# EAGLE schematic AM6548 (EAGLE 9.4.2), part 4 of 4
## Sheet 17 of 19: Management IC
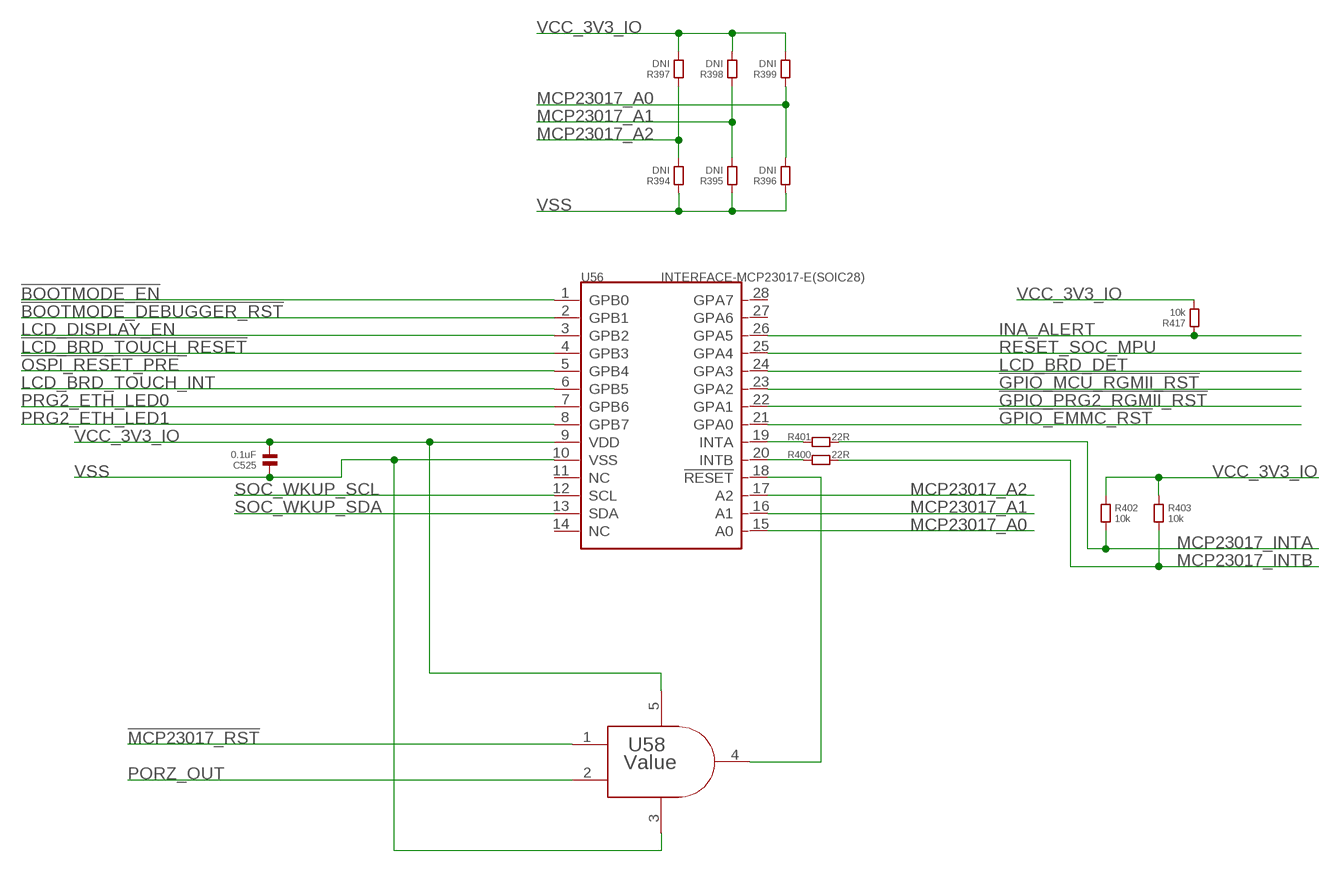
[diagram p30: schematic, sheet 17]

### Parts
C525  0.1uF  CAPACITOR.0603  [0603]
R394  DNI  RESISTOR.0402  [0402]
R395  DNI  RESISTOR.0402  [0402]
R396  DNI  RESISTOR.0402  [0402]
R397  DNI  RESISTOR.0402  [0402]
R398  DNI  RESISTOR.0402  [0402]
R399  DNI  RESISTOR.0402  [0402]
R400  22R  RESISTOR.0603  [0603]
R401  22R  RESISTOR.0603  [0603]
R402  10k  RESISTOR.0603  [0603]
R403  10k  RESISTOR.0603  [0603]
R417  10k  RESISTOR.0402  [0402]
U56  INTERFACE-MCP23017-E(SOIC28)  [SOIC28-1.27-17.9X7.5MM]
U58  Value  SN74LVC1G08DBVR  [DBV0005A_N]

### Nets
!BOOTMODE_DEBUGGER_RST: U56.2(GPB1) ; also sheet 8,11
!BOOTMODE_EN: U56.1(GPB0) ; also sheet 8,11
!GPIO_EMMC_RST: U56.21(GPA0) ; also sheet 13
!GPIO_MCU_RGMII_RST: U56.23(GPA2) ; also sheet 6
!GPIO_PRG2_RGMII_RST: U56.22(GPA1) ; also sheet 6
!LCD_BRD_TOUCH_RESET: U56.4(GPB3) ; also sheet 16
!MCP23017_RST: U58.1(A)
!OSPI_RESET_PRE: U56.5(GPB4) ; also sheet 18
INA_ALERT: R417.1 U56.26(GPA5) ; also sheet 10
LCD_BRD_DET: U56.24(GPA3) ; also sheet 16
LCD_BRD_TOUCH_INT: U56.6(GPB5) ; also sheet 16
LCD_DISPLAY_EN: U56.3(GPB2) ; also sheet 16
MCP23017_A0: R396.2 R399.1 U56.15(A0)
MCP23017_A1: R395.2 R398.1 U56.16(A1)
MCP23017_A2: R394.2 R397.1 U56.17(A2)
MCP23017_INTA: R401.2 R402.2
MCP23017_INTB: R400.2 R403.2
N$291: U56.18(!RESET) U58.4(Y)
N$292: R401.1 U56.19(INTA)
N$293: R400.1 U56.20(INTB)
PORZ_OUT: U58.2(B) ; also sheet 1,6,11,13,16,18,19
PRG2_ETH_LED0: U56.7(GPB6) ; also sheet 6
PRG2_ETH_LED1: U56.8(GPB7) ; also sheet 6
RESET_SOC_MPU: U56.25(GPA4) ; also sheet 3
SOC_WKUP_SCL: U56.12(SCL) ; also sheet 1,3,15,16,19
SOC_WKUP_SDA: U56.13(SDA) ; also sheet 1,3,15,16,19
VCC_3V3_IO: C525.2 R397.2 R398.2 R399.2 R402.1 R403.1 R417.2 U56.9(VDD) U58.5(V+) ; also sheet 1,3,5,6,7,8,9,10,11,13,14,15,16,19
VSS: C525.1 R394.1 R395.1 R396.1 U56.10(VSS) U58.3(V-) ; also sheet 1,2,3,4,5,6,7,8,9,10,11,12,13,14,15,16,18,19
Unconnected: U56.11(NC) U56.14(NC) U56.27(GPA6) U56.28(GPA7)

## Sheet 18 of 19: OSPI Flash
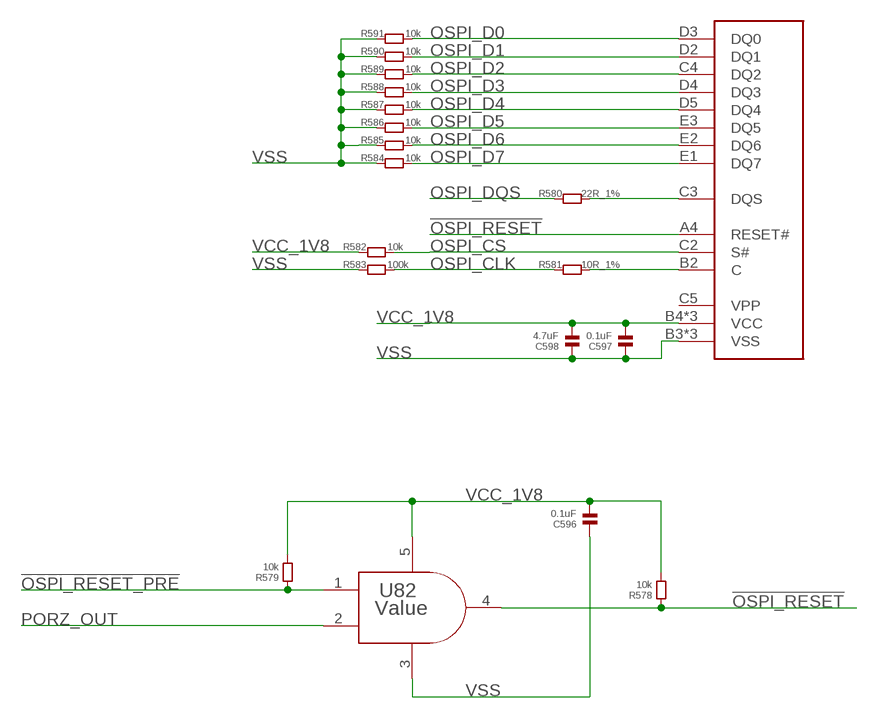
[diagram p31: schematic, sheet 18]

### Parts
C596  0.1uF  CAPACITOR.0603  [0603]
C597  0.1uF  CAPACITOR.0402  [0402]
C598  4.7uF  CAPACITOR.0402  [0402]
R578  10k  RESISTOR.0603  [0603]
R579  10k  RESISTOR.0603  [0603]
R580  22R_1%  RESISTOR.0402  [0402]
R581  10R_1%  RESISTOR.0402  [0402]
R582  10k  RESISTOR.0402  [0402]
R583  100k  RESISTOR.0402  [0402]
R584  10k  RESISTOR.0402  [0402]
R585  10k  RESISTOR.0402  [0402]
R586  10k  RESISTOR.0402  [0402]
R587  10k  RESISTOR.0402  [0402]
R588  10k  RESISTOR.0402  [0402]
R589  10k  RESISTOR.0402  [0402]
R590  10k  RESISTOR.0402  [0402]
R591  10k  RESISTOR.0402  [0402]
U82  Value  SN74LVC1G08DBVR  [DBV0005A_N]
U$38  MT35XU512ABA1G12-0SITT-PBGA-24  [BGA25C100P5X5_800X600X100]

### Nets
!OSPI_RESET: R578.1 U82.4(Y) U$38.A4(RESET#)
!OSPI_RESET_PRE: R579.1 U82.1(A) ; also sheet 17
N$369: R580.2 U$38.C3(DQS)
N$408: R581.2 U$38.B2(C)
OSPI_CLK: R581.1 R583.2 ; also sheet 1
OSPI_CS: R582.2 U$38.C2(S#) ; also sheet 1
OSPI_D0: R591.2 U$38.D3(DQ0) ; also sheet 1
OSPI_D1: R590.2 U$38.D2(DQ1) ; also sheet 1
OSPI_D2: R589.2 U$38.C4(DQ2) ; also sheet 1
OSPI_D3: R588.2 U$38.D4(DQ3) ; also sheet 1
OSPI_D4: R587.2 U$38.D5(DQ4) ; also sheet 1
OSPI_D5: R586.2 U$38.E3(DQ5) ; also sheet 1
OSPI_D6: R585.2 U$38.E2(DQ6) ; also sheet 1
OSPI_D7: R584.2 U$38.E1(DQ7) ; also sheet 1
OSPI_DQS: R580.1 ; also sheet 1
PORZ_OUT: U82.2(B) ; also sheet 1,6,11,13,16,17,19
VCC_1V8: C596.2 C597.2 C598.2 R578.2 R579.2 R582.1 U82.5(V+) U$38.B4(VCC) U$38.D1(VCC) U$38.E4(VCC) ; also sheet 1,3,6,7,8,10,13,14,15,19
VSS: C596.1 C597.1 C598.1 R583.1 R584.1 R585.1 R586.1 R587.1 R588.1 R589.1 R590.1 R591.1 U82.3(V-) U$38.B3(VSS) U$38.C1(VSS) U$38.E5(VSS) ; also sheet 1,2,3,4,5,6,7,8,9,10,11,12,13,14,15,16,17,19
Unconnected: U$38.C5(VPP)

## Sheet 19 of 19: External Interfaces
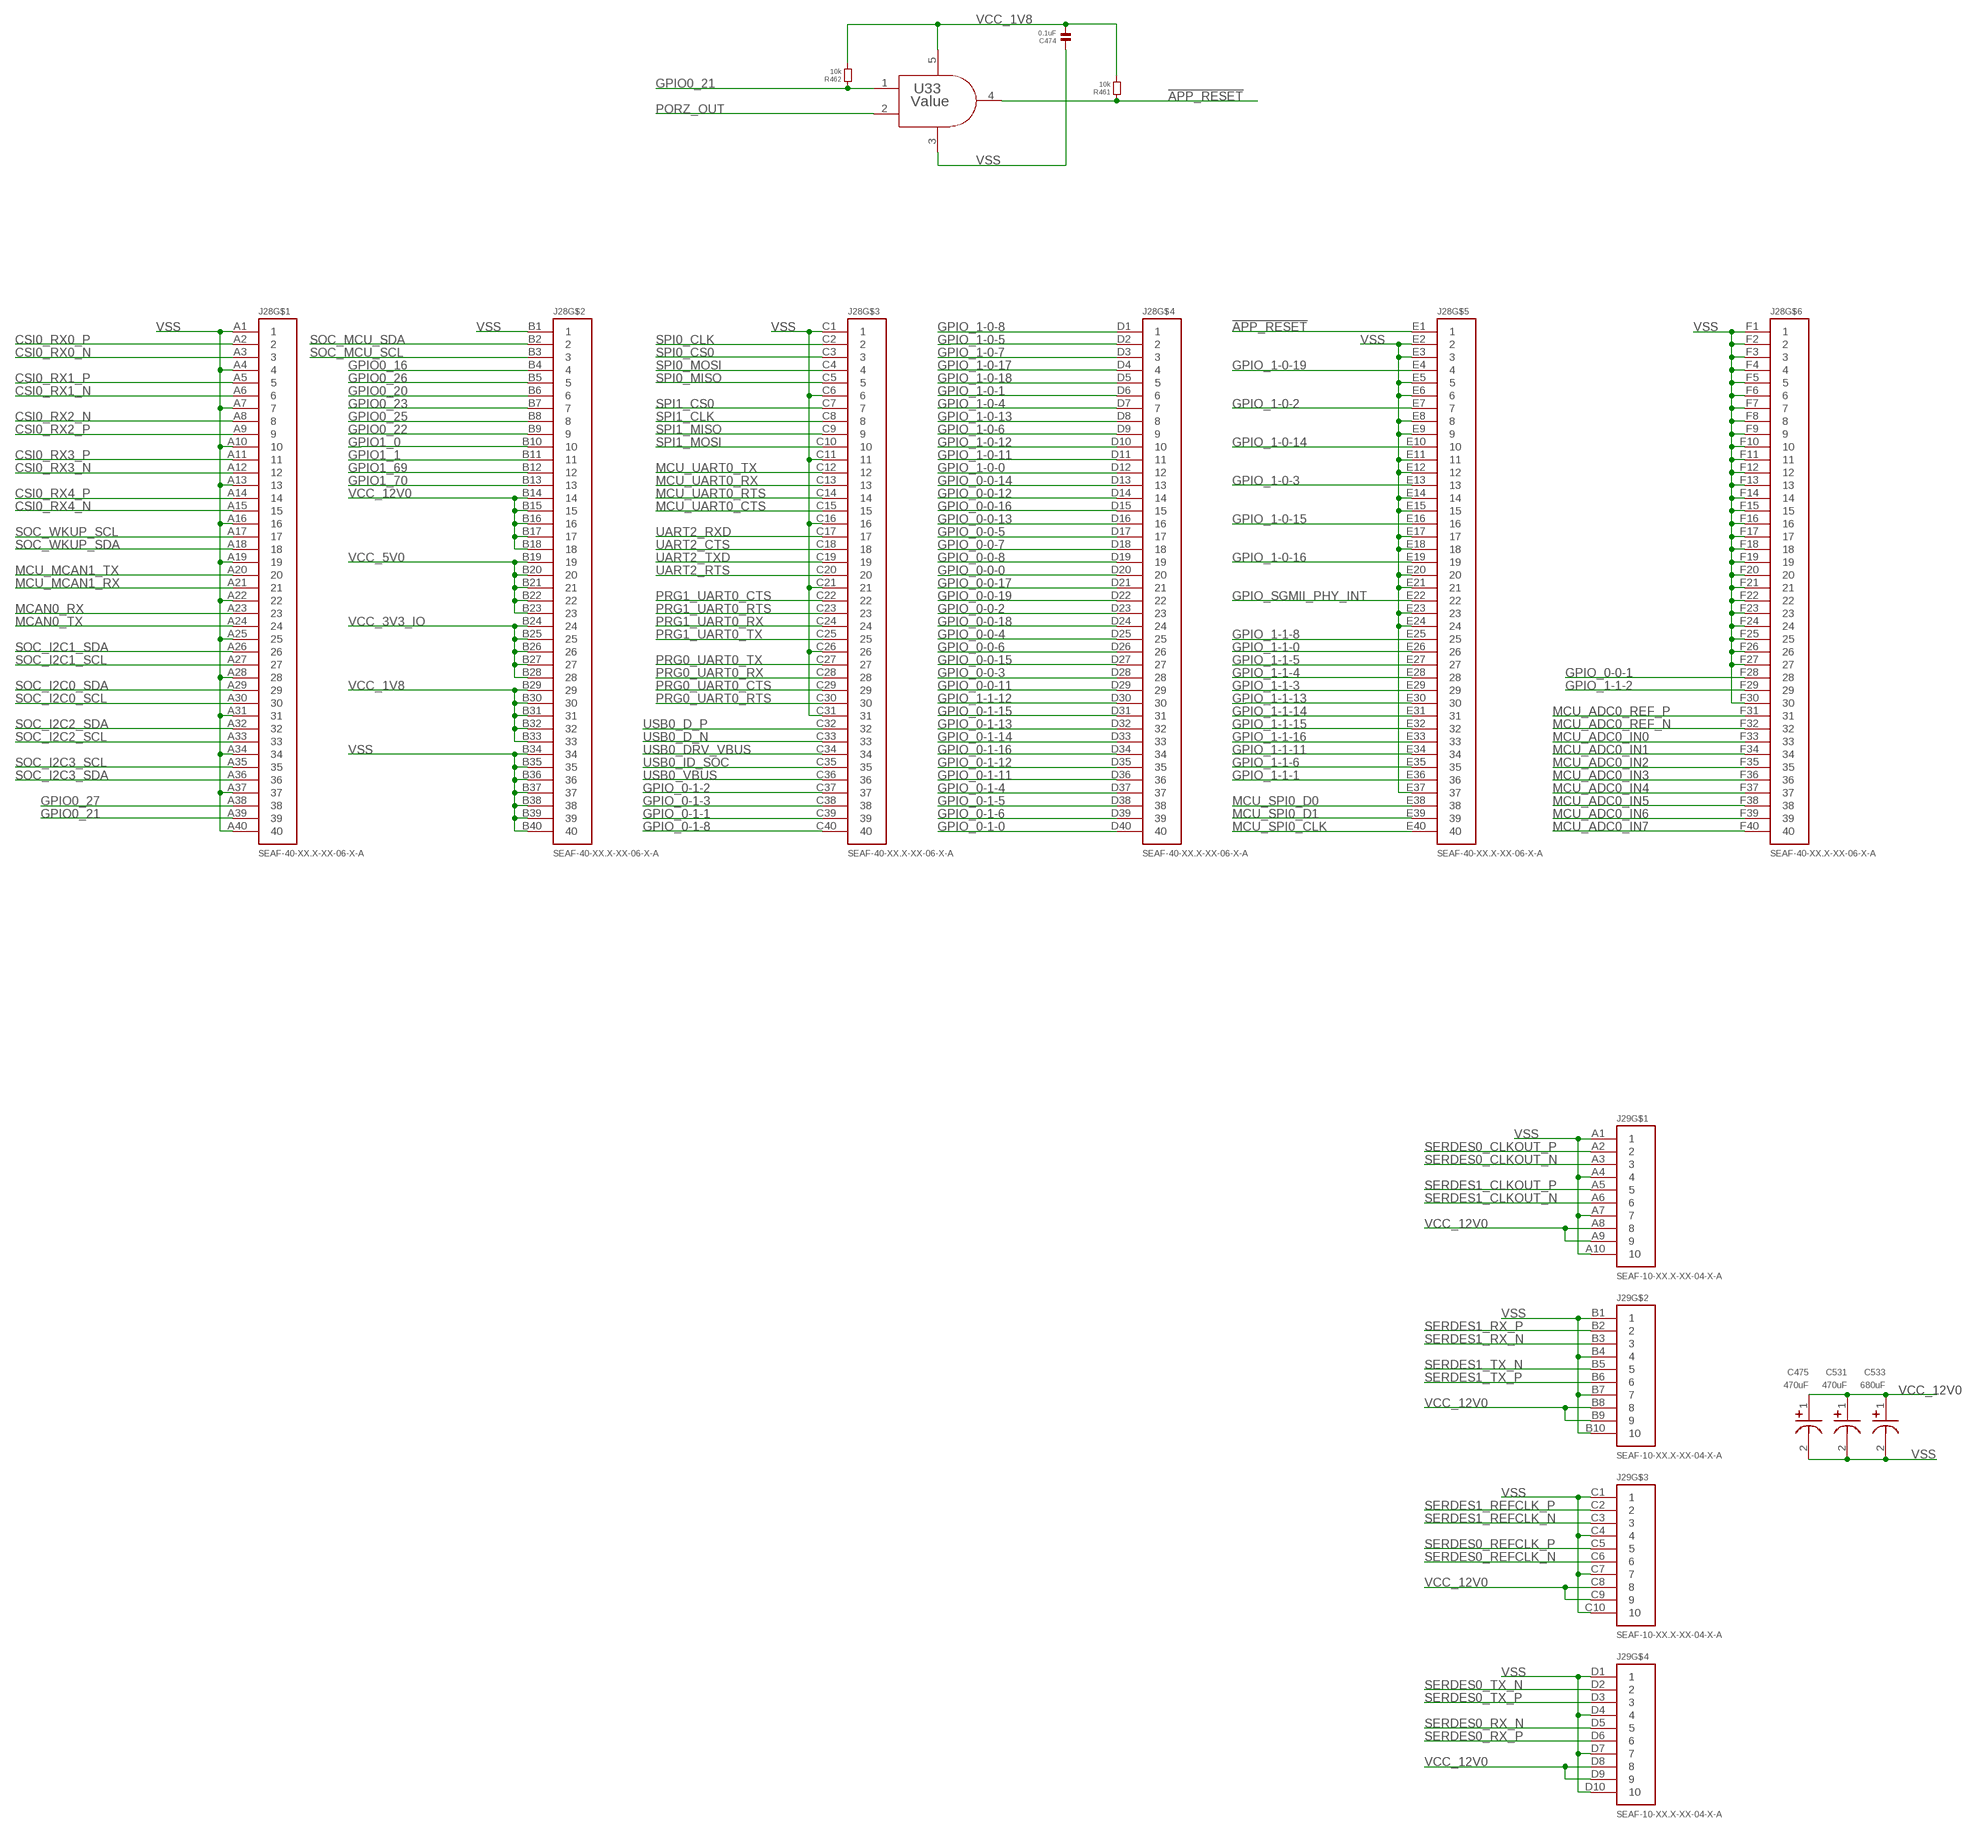
[diagram p32: schematic, sheet 19]

### Parts
C474  0.1uF  CAPACITOR.0603  [0603]
C475  470uF  CAPACITOR_POLARIZED1  [CAPPRD300W65D800H1200B]
C531  470uF  CAPACITOR_POLARIZED1  [CAPPRD300W65D800H1200B]
C533  680uF  CAPACITOR_POLARIZED1  [CAPPRD300W65D800H1200B]
J28  SEAF-40-XX.X-XX-06-X-A  [SEAF-40-XX.X-XX-06-X-A]
J29  SEAF-10-XX.X-XX-04-X-A  [SEAF-10-XX.X-XX-04-X-A]
R461  10k  RESISTOR.0603  [0603]
R462  10k  RESISTOR.0603  [0603]
U33  Value  SN74LVC1G08DBVR  [DBV0005A_N]

### Nets
!APP_RESET: J28.E1 R461.1 U33.4(Y)
CSI0_RX0_N: J28.A3 ; also sheet 1
CSI0_RX0_P: J28.A2 ; also sheet 1
CSI0_RX1_N: J28.A6 ; also sheet 1
CSI0_RX1_P: J28.A5 ; also sheet 1
CSI0_RX2_N: J28.A8 ; also sheet 1
CSI0_RX2_P: J28.A9 ; also sheet 1
CSI0_RX3_N: J28.A12 ; also sheet 1
CSI0_RX3_P: J28.A11 ; also sheet 1
CSI0_RX4_N: J28.A15 ; also sheet 1
CSI0_RX4_P: J28.A14 ; also sheet 1
GPIO0_16: J28.B4 ; also sheet 12
GPIO0_20: J28.B6 ; also sheet 12
GPIO0_21: J28.A39 R462.1 U33.1(A) ; also sheet 12
GPIO0_22: J28.B9 ; also sheet 12
GPIO0_23: J28.B7 ; also sheet 12
GPIO0_25: J28.B8 ; also sheet 12
GPIO0_26: J28.B5 ; also sheet 12
GPIO0_27: J28.A38 ; also sheet 12
GPIO1_0: J28.B10 ; also sheet 1,8
GPIO1_1: J28.B11 ; also sheet 1,8
GPIO1_69: J28.B12 ; also sheet 1
GPIO1_70: J28.B13 ; also sheet 1
GPIO_0-0-0 [5mil]: J28.D20 ; also sheet 1
GPIO_0-0-1 [5mil]: J28.F28 ; also sheet 1
GPIO_0-0-2 [5mil]: J28.D23 ; also sheet 1
GPIO_0-0-3 [5mil]: J28.D28 ; also sheet 1
GPIO_0-0-4 [5mil]: J28.D25 ; also sheet 1
GPIO_0-0-5 [5mil]: J28.D17 ; also sheet 1
GPIO_0-0-6 [5mil]: J28.D26 ; also sheet 1
GPIO_0-0-7 [5mil]: J28.D18 ; also sheet 1
GPIO_0-0-8 [5mil]: J28.D19 ; also sheet 1
GPIO_0-0-11 [5mil]: J28.D29 ; also sheet 1
GPIO_0-0-12 [5mil]: J28.D14 ; also sheet 1
GPIO_0-0-13 [5mil]: J28.D16 ; also sheet 1
GPIO_0-0-14 [5mil]: J28.D13 ; also sheet 1
GPIO_0-0-15 [5mil]: J28.D27 ; also sheet 1
GPIO_0-0-16 [5mil]: J28.D15 ; also sheet 1
GPIO_0-0-17 [5mil]: J28.D21 ; also sheet 1
GPIO_0-0-18 [5mil]: J28.D24 ; also sheet 1
GPIO_0-0-19 [5mil]: J28.D22 ; also sheet 1
GPIO_0-1-0 [5mil]: J28.D40 ; also sheet 1
GPIO_0-1-1 [5mil]: J28.C39 ; also sheet 1
GPIO_0-1-2 [5mil]: J28.C37 ; also sheet 1
GPIO_0-1-3 [5mil]: J28.C38 ; also sheet 1
GPIO_0-1-4 [5mil]: J28.D37 ; also sheet 1
GPIO_0-1-5 [5mil]: J28.D38 ; also sheet 1
GPIO_0-1-6 [5mil]: J28.D39 ; also sheet 1
GPIO_0-1-8 [5mil]: J28.C40 ; also sheet 1
GPIO_0-1-11 [5mil]: J28.D36 ; also sheet 1
GPIO_0-1-12 [5mil]: J28.D35 ; also sheet 1
GPIO_0-1-13 [5mil]: J28.D32 ; also sheet 1
GPIO_0-1-14 [5mil]: J28.D33 ; also sheet 1
GPIO_0-1-15 [5mil]: J28.D31 ; also sheet 1
GPIO_0-1-16 [5mil]: J28.D34 ; also sheet 1
GPIO_1-0-0 [5mil]: J28.D12 ; also sheet 1
GPIO_1-0-1 [5mil]: J28.D6 ; also sheet 1
GPIO_1-0-2 [5mil]: J28.E7 ; also sheet 1
GPIO_1-0-3 [5mil]: J28.E13 ; also sheet 1
GPIO_1-0-4 [5mil]: J28.D7 ; also sheet 1
GPIO_1-0-5 [5mil]: J28.D2 ; also sheet 1
GPIO_1-0-6 [5mil]: J28.D9 ; also sheet 1
GPIO_1-0-7 [5mil]: J28.D3 ; also sheet 1
GPIO_1-0-8 [5mil]: J28.D1 ; also sheet 1
GPIO_1-0-11 [5mil]: J28.D11 ; also sheet 1
GPIO_1-0-12 [5mil]: J28.D10 ; also sheet 1
GPIO_1-0-13 [5mil]: J28.D8 ; also sheet 1
GPIO_1-0-14 [5mil]: J28.E10 ; also sheet 1
GPIO_1-0-15 [5mil]: J28.E16 ; also sheet 1
GPIO_1-0-16 [5mil]: J28.E19 ; also sheet 1
GPIO_1-0-17 [5mil]: J28.D4 ; also sheet 1
GPIO_1-0-18 [5mil]: J28.D5 ; also sheet 1
GPIO_1-0-19 [5mil]: J28.E4 ; also sheet 1
GPIO_1-1-0 [5mil]: J28.E26 ; also sheet 1
GPIO_1-1-1 [5mil]: J28.E36 ; also sheet 1
GPIO_1-1-2 [5mil]: J28.F29 ; also sheet 1
GPIO_1-1-3 [5mil]: J28.E29 ; also sheet 1
GPIO_1-1-4 [5mil]: J28.E28 ; also sheet 1
GPIO_1-1-5 [5mil]: J28.E27 ; also sheet 1
GPIO_1-1-6 [5mil]: J28.E35 ; also sheet 1
GPIO_1-1-8 [5mil]: J28.E25 ; also sheet 1
GPIO_1-1-11 [5mil]: J28.E34 ; also sheet 1
GPIO_1-1-12 [5mil]: J28.D30 ; also sheet 1
GPIO_1-1-13 [5mil]: J28.E30 ; also sheet 1
GPIO_1-1-14 [5mil]: J28.E31 ; also sheet 1
GPIO_1-1-15 [5mil]: J28.E32 ; also sheet 1
GPIO_1-1-16 [5mil]: J28.E33 ; also sheet 1
GPIO_SGMII_PHY_INT: J28.E22 ; also sheet 1
MCAN0_RX: J28.A23 ; also sheet 1
MCAN0_TX: J28.A24 ; also sheet 1
MCU_ADC0_IN0: J28.F33 ; also sheet 1
MCU_ADC0_IN1: J28.F34 ; also sheet 1
MCU_ADC0_IN2: J28.F35 ; also sheet 1
MCU_ADC0_IN3: J28.F36 ; also sheet 1
MCU_ADC0_IN4: J28.F37 ; also sheet 1
MCU_ADC0_IN5: J28.F38 ; also sheet 1
MCU_ADC0_IN6: J28.F39 ; also sheet 1
MCU_ADC0_IN7: J28.F40 ; also sheet 1
MCU_ADC0_REF_N: J28.F32 ; also sheet 1
MCU_ADC0_REF_P: J28.F31 ; also sheet 1
MCU_MCAN1_RX: J28.A21 ; also sheet 1
MCU_MCAN1_TX: J28.A20 ; also sheet 1
MCU_SPI0_CLK: J28.E40 ; also sheet 1
MCU_SPI0_D0: J28.E38 ; also sheet 1
MCU_SPI0_D1: J28.E39 ; also sheet 1
MCU_UART0_CTS: J28.C15 ; also sheet 1
MCU_UART0_RTS: J28.C14 ; also sheet 1
MCU_UART0_RX: J28.C13 ; also sheet 1
MCU_UART0_TX: J28.C12 ; also sheet 1
PORZ_OUT: U33.2(B) ; also sheet 1,6,11,13,16,17,18
PRG0_UART0_CTS: J28.C29 ; also sheet 1
PRG0_UART0_RTS: J28.C30 ; also sheet 1
PRG0_UART0_RX: J28.C28 ; also sheet 1
PRG0_UART0_TX: J28.C27 ; also sheet 1
PRG1_UART0_CTS: J28.C22 ; also sheet 1
PRG1_UART0_RTS: J28.C23 ; also sheet 1
PRG1_UART0_RX: J28.C24 ; also sheet 1
PRG1_UART0_TX: J28.C25 ; also sheet 1
SERDES0_CLKOUT_N: J29.A3 ; also sheet 1
SERDES0_CLKOUT_P: J29.A2 ; also sheet 1
SERDES0_REFCLK_N: J29.C6 ; also sheet 1
SERDES0_REFCLK_P: J29.C5 ; also sheet 1
SERDES0_RX_N: J29.D5 ; also sheet 1
SERDES0_RX_P: J29.D6 ; also sheet 1
SERDES0_TX_N: J29.D2 ; also sheet 1
SERDES0_TX_P: J29.D3 ; also sheet 1
SERDES1_CLKOUT_N: J29.A6 ; also sheet 1
SERDES1_CLKOUT_P: J29.A5 ; also sheet 1
SERDES1_REFCLK_N: J29.C3 ; also sheet 1
SERDES1_REFCLK_P: J29.C2 ; also sheet 1
SERDES1_RX_N: J29.B3 ; also sheet 1
SERDES1_RX_P: J29.B2 ; also sheet 1
SERDES1_TX_N: J29.B5 ; also sheet 1
SERDES1_TX_P: J29.B6 ; also sheet 1
SOC_I2C0_SCL: J28.A30 ; also sheet 1,14
SOC_I2C0_SDA: J28.A29 ; also sheet 1,14
SOC_I2C1_SCL: J28.A27 ; also sheet 1,16
SOC_I2C1_SDA: J28.A26 ; also sheet 1,16
SOC_I2C2_SCL: J28.A33 ; also sheet 8,10,12,15
SOC_I2C2_SDA: J28.A32 ; also sheet 8,10,12,15
SOC_I2C3_SCL: J28.A35 ; also sheet 1
SOC_I2C3_SDA: J28.A36 ; also sheet 1
SOC_MCU_SCL: J28.B3 ; also sheet 1,15
SOC_MCU_SDA: J28.B2 ; also sheet 1,15
SOC_WKUP_SCL: J28.A17 ; also sheet 1,3,15,16,17
SOC_WKUP_SDA: J28.A18 ; also sheet 1,3,15,16,17
SPI0_CLK: J28.C2 ; also sheet 1
SPI0_CS0: J28.C3 ; also sheet 1
SPI0_MISO: J28.C5 ; also sheet 1
SPI0_MOSI: J28.C4 ; also sheet 1
SPI1_CLK: J28.C8 ; also sheet 1,16
SPI1_CS0: J28.C7 ; also sheet 1,16
SPI1_MISO: J28.C9 ; also sheet 1,16
SPI1_MOSI: J28.C10 ; also sheet 1,16
UART2_CTS: J28.C18 ; also sheet 1
UART2_RTS: J28.C20 ; also sheet 1
UART2_RXD: J28.C17 ; also sheet 1
UART2_TXD: J28.C19 ; also sheet 1
USB0_D_N [6mil]: J28.C33 ; also sheet 1
USB0_D_P [6mil]: J28.C32 ; also sheet 1
USB0_DRV_VBUS [6mil]: J28.C34 ; also sheet 1
USB0_ID_SOC [6mil]: J28.C35 ; also sheet 1
USB0_VBUS: J28.C36 ; also sheet 9
VCC_1V8: C474.2 J28.B29 J28.B30 J28.B31 J28.B32 J28.B33 R461.2 R462.2 U33.5(V+) ; also sheet 1,3,6,7,8,10,13,14,15,18
VCC_3V3_IO: J28.B24 J28.B25 J28.B26 J28.B27 J28.B28 ; also sheet 1,3,5,6,7,8,9,10,11,13,14,15,16,17
VCC_5V0: J28.B19 J28.B20 J28.B21 J28.B22 J28.B23 ; also sheet 3,7,8,9,16
VCC_12V0: C475.1(+) C531.1(+) C533.1(+) J28.B14 J28.B15 J28.B16 J28.B17 J28.B18 J29.A8 J29.A9 J29.B8 J29.B9 J29.C8 J29.C9 J29.D8 J29.D9 ; also sheet 3
VSS: C474.1 C475.2(-) C531.2(-) C533.2(-) J28.A1 J28.A4 J28.A7 J28.A10 J28.A13 J28.A16 J28.A19 J28.A22 J28.A25 J28.A28 J28.A31 J28.A34 J28.A37 J28.A40 J28.B1 J28.B34 J28.B35 J28.B36 J28.B37 J28.B38 J28.B39 J28.B40 J28.C1 J28.C6 J28.C11 J28.C16 J28.C21 J28.C26 J28.C31 J28.E2 J28.E3 J28.E5 J28.E6 J28.E8 J28.E9 J28.E11 J28.E12 J28.E14 J28.E15 J28.E17 J28.E18 J28.E20 J28.E21 J28.E23 J28.E24 J28.E37 J28.F1 J28.F2 J28.F3 J28.F4 J28.F5 J28.F6 J28.F7 J28.F8 J28.F9 J28.F10 J28.F11 J28.F12 J28.F13 J28.F14 J28.F15 J28.F16 J28.F17 J28.F18 J28.F19 J28.F20 J28.F21 J28.F22 J28.F23 J28.F24 J28.F25 J28.F26 J28.F27 J28.F30 J29.A1 J29.A4 J29.A7 J29.A10 J29.B1 J29.B4 J29.B7 J29.B10 J29.C1 J29.C4 J29.C7 J29.C10 J29.D1 J29.D4 J29.D7 J29.D10 U33.3(V-) ; also sheet 1,2,3,4,5,6,7,8,9,10,11,12,13,14,15,16,17,18

## Power pins joined to a net without a drawn wire
RSV11: U1.A27(I:RSV11)
VDDA1P8: U14.48(VDDA1P8) U54.48(VDDA1P8) U55.48(VDDA1P8)
VDDA1P8_2: U14.13(VDDA1P8_2) U54.13(VDDA1P8_2) U55.13(VDDA1P8_2)

## Library data of the parts
C1-C157 C159-C474 C476-C530 C566-C572 C574-C582 C585-C599 C602-C612 C615-C618 C623-C635 = standardparts:CAPACITOR
C158 C532 C583 C584 C600 C601 C613 C614 C619-C622 = adafruit:CPOL-US: POLARIZED CAPACITOR, American symbol
C475 C531 C533 = Module_Capacitors:CAPACITOR_POLARIZED
D1 D2 D5 D6 D8 D19-D22 D25-D27 D29-D31 = standardparts:LED
D3 D4 D7 D23 = TPD1E10B06DPYT:TPD1E10B06DPYT: Single Channel ESD in 0402 package with 10pF Capacitance and 6V Breakdown 2-X1SON -40 to 125; AVAILABILITY: Unavailable; DESCRIPTION: Single-Channel ESD in 0402 Package With 10pF Capacitance and 6V Breakdown 2-X1SON -40 to 125; MF: Texas Instruments; MP: TPD1E10B06DPYT; PACKAGE: XDFN-2 Texas Instruments; PRICE: None
D24 = diode:DIODE-: DIODE
D28 = microbuilder:DIODE: Diode SMA Model Volts Amps Type Vf Vr Digikey # Notes SSA34-E3 40V 3A Schottky 480mV @ 3A 200uA @ 40V SSA34-E3/61TGITR-ND CDBA120-G 20V 1A Schottky 500mV @ 1A 500uA @ 20V 641-1014-6-ND REEL MBRA210 10V 2A Schottky 350mV @ 2A 700uA @ 10V MBRA210LT3 SOD-123 Model Volts Amps Type Vf Vr Order # Notes BAT54T1G 30V 200mA Schottky 800mV @ 200mA 2uA @ 25V BAT54T1GOSTR-ND B0530W 30V 500mA Schottky 430mV @ 500mA 130uA @ 30V B0530W-FDICT-ND REEL MBR120 1A 20V Schottky 340mV @ 1A MBR120VLSFT1GOSCT-ND SOD-323 Model Volts Amps Type Vf Vr Order # Notes PMEG2005EJ 20V 500mA Schottky 355mV @ 500mA 568-4110-1-ND ZLLS410 10V 570mA Schottky 380mV @ 570mA ZLLS410CT-ND 1N4148WS 75V 150mA Silicon/Simple 1V 1N4148WSFSCT-ND REEL SOD-523 Model Volts Amps Type Vf Vr Order # Notes BAT54XV2 30V 200mA Schottky 0.8V @ 100mA BAT54XV2CT-ND TB751S 30V 30mA Schottky RB751S-40TE61CT-ND SOT23-R/W (R = Solder Paste/Reflow Ovens, W = Hand-Soldering) Model Volts Amps Type Vf Vr Order # Notes BAT54FILM 40V 300mA Schottky 497-7162-1-ND
F1 = fuse:TR5: FUSE Wickmann; OC_FARNELL: unknown; OC_NEWARK: unknown
FL1-FL22 FL26-FL28 FL50 FL51 = standardparts:RF-INDUCTOR
J1-J9 J11-J25 R1-R204 R206-R216 R218-R431 R433-R445 R447-R459 R461-R464 R484-R512 R524-R618 R700 R701 = standardparts:RESISTOR
J10 J26 J29 = SEAF-10-XX.X-XX-04-X-A:SEAF-10-XX.X-XX-04-X-A: .050 PITCH SOCKET ARRAY ASSEMBLY.; AVAILABILITY: Unavailable; DESCRIPTION: .050 SEARAY™ High-Speed High-Density Open-Pin-Field Array Socket 10 positions; MF: Samtec; MP: SEAF-10-XX.X-XX-04-X-A; PACKAGE: None; PRICE: None
J27 = adafruit:1X2: 3.5mm Terminal block http://www.ladyada.net/library/pcb/eaglelibrary.html
J28 = SEAF-40-XX.X-XX-06-X-A:SEAF-40-XX.X-XX-06-X-A: Socket Array Assembly, Surface Mount, 0.050 inch Pitch, 240 Pins
JP1 JP2 JP5 JP6 = pinhead:PINHD-1X3: PIN HEADER
JP3 = pinhead:PINHD-2X10: PIN HEADER
JP4 = pinhead:PINHD-2X5: PIN HEADER
JP7 = pinhead:PINHD-2X20: PIN HEADER
JP8 = pinhead:PINHD-2X3: PIN HEADER
JP9 = SparkFun-Retired:USD-SDIO-SOCKET: microSD Socket Push-push type uSD socket with full SDIO signal mapping. Spark Fun Electronics SKU : PRT-00127. tDoc lines correctly indicate media card edge positions when inserting (unlocked, locked, depressed). NOTE: CD1 and CD2 are connected internally, and short to ground when card is removed.; PROD_ID: CONN-07820
P1 = SOIC127P600X175-8N:SOIC127P600X175-8N; A1_MAX: None; A1_MIN: 0.175; A1_NOM: None; A_MAX: 1.75; A_MIN: None; A_NOM: None; B_MAX: 0.51; B_MIN: 0.31; B_NOM: 0.41; D2_MAX: 0.0; D2_MIN: None; D2_NOM: None; D_MAX: 5.0; D_MIN: 4.8; D_NOM: 4.9; E1_MAX: 3.9; E1_MIN: 3.8; E1_NOM: 3.85; E2_MAX: 0.0; E2_MIN: None; E2_NOM: None; ENOM: 1.27; E_MAX: 6.1; E_MIN: 5.9; E_NOM: 6.0; L_MAX: 1.27; L_MIN: 0.4; L_NOM: 0.835; MANUFACTURER: Microchip; PIN_COUNT: 8.0; SNAPEDA_PACKAGE_ID: 23270
Q1-Q7 Q12-Q17 = SparkFun-DiscreteSemi:MOSFET-NCH: N-channel MOSFETs Voltage controlled devices that allow control of high current outputs. SparkFun Products: SparkFun OpenScale <https://www.sparkfun.com/products/13261> SparkFun Digital Sandbox <https://www.sparkfun.com/products/12651> SparkFun Monster Moto Shield <https://www.sparkfun.com/products/10182> SparkFun MOSFET Power Controller <https://www.sparkfun.com/products/11214>; PROD_ID: TRANS-00830
Q8-Q11 = CSD18543Q3A:CSD18543Q3A: 60V N-Channel NexFET™ Power MOSFET 8-VSONP -55 to 150; AVAILABILITY: Unavailable; DESCRIPTION: 60V N-Channel NexFET™ Power MOSFET 8-VSONP -55 to 150; MF: Texas Instruments; MP: CSD18543Q3A; PACKAGE: VSON-8 Texas Instruments; PRICE: None
Q18 = microbuilder:MOSFET-P: P-Channel Mosfet LEGEND VDS: Voltage Drain-Source ID: Drain Current RDS(ON): Drain-Source On-State Resistance VGS(TH): Gate-Source Threshold Voltage CISS: Drain-Source Input Capacitance SOT-23 Name VDS ID RDS(ON) VGS(TH) CISS Order Number IRLML5103 30V 760mA 600 mOhm -- 75pF @ 25V Digikey: IRLML5103PBFCT-ND IRLML6401 12V 4.3A 50 mOhm 950mV @ 250µA 830pF @ 10V Digikey: IRLML6401PBFTR-ND NTR0202PL 20V 400mA 800 mOhm 2.3V @ 250uA 70pF @ 5V Digikey: NTR0202PLT1GOSTR-ND NTR4101PT1G 20V 1.8A 85 mOhm 1.2V @ 250uA 675pF @ 10V Digikey: NTR4101PT1GOSCT-ND DMP2004K 20V 600mA 900 mOhm 1V @ 250uA 175pF @ 16V Digikey: DMP2004KDICT-ND PMV65XP 20V 3.9A 76 mOhm 950mV @ 1mA 725pF @ 20V Digikey: 568-2358-2-ND TO-252 Name VDS ID RDS(ON) VGS(TH) CISS Order Number AOD417 30V 25A 34 mOhm 3V @ 250µA 920pF @ 15V Digikey: 785-1106-2-ND
Q19 Q20 = SparkFun-DiscreteSemi:MOSFET-NCH: N-channel MOSFETs Voltage controlled devices that allow control of high current outputs. SparkFun Products: SparkFun OpenScale <https://www.sparkfun.com/products/13261> SparkFun Digital Sandbox <https://www.sparkfun.com/products/12651> SparkFun Monster Moto Shield <https://www.sparkfun.com/products/10182> SparkFun MOSFET Power Controller <https://www.sparkfun.com/products/11214>; PROD_ID: TRANS-12437
Q21 = semiconductor:BSS138: N-Channel Logic Level Enhancement Mode Field Effect Transistor. 50V, continuous current max 0.22A, pulsed max 0.88A. Maximum power dissipation 0.36W.
R205 R217 = adafruit:R-US_: RESISTOR, American symbol
R432 R446 R460 = standardparts:RESISTOR; SPICEPREFIX: R
S1-S4 = SparkFun:TAC_SWITCH: Momentary Switch Button commonly used for reset or general input. Spark Fun Electronics SKU : COM-00097
S5 S9 = adafruit:EG1218: SLIDING SWITCH 0.1" spacing through hole, vertical SPDT slide switch http://www.ladyada.net/library/pcb/eaglelibrary.html
S6 S7 = smd-special:SWS010: SMD Dip Switch 10 pol.
S8 = smd-special:SWS004: SMD Dip Switch 4 pol.
SMCJ64CA = SparkFun:TVS
TP2-TP9 TP14-TP39 = BeagleBone_Blue_R3:TESTPAD_TPSQ: Test pad
U1 = AM6548:AM6548ACDXEAF; MANUFACTURER: Texas Instruments; PARTNUMBER: AM6548ACDXEAF; REFDES: RefDes; TYPE: TYPE
U2-U9 = Module_Regulators:INA226_DGS_10; DATASHEETURL: httpwww.ti.comlitgpnINA226; FAMILY_NAME: CURRENT SHUNT MONITOR; GENERIC_PART_NUMBER: INA226; INDUSTRY_STD_PKG_TYPE: MSOP; MANUFACTURER: Texas Instruments; MANUFACTURER_PART_NUMBER: ina226_dgs_10; PACKAGE_DESIGNATOR: DGS; PIN_COUNT: 10; VENDOR: Texas Instruments
U10 = Module_ICs:TCA6424ARGJR; COMPTYPE: IC; MANUFACTURER: Texas Instruments; MOUNTTYPE: SMT; PACKAGEREFERENCE: RGJ0032A; PARTNUMBER: TCA6424ARGJR; PIN_COUNT: 33; REFDES: RefDes; ROHS: Y; TYPE: TYPE
U11 U12 = Module_ICs:SN74AVC8T245RHLR; COMPTYPE: IC; MANUFACTURER: Texas Instruments; MOUNTTYPE: SMT; PACKAGEREFERENCE: RHL0024A; PARTNUMBER: SN74AVC8T245RHL; PIN_COUNT: 25; REFDES: RefDes; ROHS: Y; TYPE: TYPE
U13 U21 U25 = Module_ICs:SN74AVC4T245_RGY_16; DATASHEETURL: httpwww.ti.comlitgpnSN74AVC4T245; FAMILY_NAME: DIRECTION CONTROL DUAL SUPPLY TRANSLATOR; GENERIC_PART_NUMBER: SN74AVC4T245; INDUSTRY_STD_PKG_TYPE: VQFN; MANUFACTURER: Texas Instruments; MANUFACTURER_PART_NUMBER: sn74avc4t245_rgy_16; PACKAGE_DESIGNATOR: RGY; PIN_COUNT: 16; VENDOR: Texas Instruments
U14 U54 U55 = DP83867:DP83867IRRGZR; ALTERNATEPARTNUMBER: DP83867IRRGZT; APPLICATION_BUILDNUMBER: *; COMPTYPE: IC; MANUFACTURER: Texas Instruments; MOUNTTYPE: SMT; PACKAGEREFERENCE: RGZ0048B; PARTNUMBER: DP83867IRRGZR; PIN_COUNT: 49; REFDES: RefDes; ROHS: Y; TYPE: TYPE
U15 U75 = Module_Gates:SN74AVC2T245RSWR; MANUFACTURER: Texas Instruments; PARTNUMBER: SN74AVC2T245RSWR; REFDES: RefDes; TYPE: TYPE
U16 U24 U27 U46 = Module_Gates:TXS0102DCUR; MANUFACTURER: Texas Instruments; PARTNUMBER: TXS0102DCUR; REFDES: RefDes; TYPE: TYPE
U17 U33 U49-U52 U57 U58 U81 U82 = Module_Gates:SN74LVC1G08DBVR; ALTERNATEPARTNUMBER: SN74LVC1G08DBVT; APPLICATION_BUILDNUMBER: *; COMPTYPE: IC; MANUFACTURER: Texas Instruments; MOUNTTYPE: SMT; PACKAGEREFERENCE: DBV0005A; PARTNUMBER: SN74LVC1G08DBVR; PIN_COUNT: 5; REFDES: RefDes; ROHS: Y; TYPE: TYPE
U18 = Module_ICs:TM4C1294NCPDTI3R; ALTERNATEPARTNUMBER: TM4C1294NCPDTI3; APPLICATION_BUILDNUMBER: *; COMPTYPE: IC; MANUFACTURER: Texas Instruments; MOUNTTYPE: SMT; PACKAGEREFERENCE: PDT0128A; PARTNUMBER: TM4C1294NCPDTI3R; PIN_COUNT: 128; REFDES: RefDes; ROHS: Y; TYPE: TYPE
U19 = Module_Regulators:TPD4E004_DRY_6; DATASHEETURL: httpwww.ti.comlitgpnTPD4E004; FAMILY_NAME: ESD Solution; GENERIC_PART_NUMBER: TPD4E004; INDUSTRY_STD_PKG_TYPE: SON; MANUFACTURER: Texas Instruments; MANUFACTURER_PART_NUMBER: tpd4e004_dry_6; PACKAGE_DESIGNATOR: DRY; PIN_COUNT: 6; VENDOR: Texas Instruments
U20 = Module_ICs:SN74LVC1G04DCKR; ALTERNATEPARTNUMBER: SN74LVC1G04DCKT; COMPTYPE: IC; MANUFACTURER: Texas Instruments; MOUNTTYPE: SMT; PACKAGEREFERENCE: DCK0005A; PARTNUMBER: SN74LVC1G04DCKR; PIN_COUNT: 5; REFDES: RefDes; ROHS: Y; TYPE: TYPE
U22 U26 = Module_ICs:SN74AVC2T244_DQM_8; DATASHEETURL: httpwww.ti.comlitgpnSN74AVC2T244; FAMILY_NAME: DIRECTION CONTROL DUAL SUPPLY TRANSLATOR; GENERIC_PART_NUMBER: SN74AVC2T244; INDUSTRY_STD_PKG_TYPE: X2SON; MANUFACTURER: Texas Instruments; MANUFACTURER_PART_NUMBER: sn74avc2t244_dqm_8; PACKAGE_DESIGNATOR: DQM; PIN_COUNT: 8; VENDOR: Texas Instruments
U23 U28-U31 = Module_Gates:SN74LVC1G32_DBV_5; DATASHEETURL: httpwww.ti.comlitgpnSN74LVC1G32; FAMILY_NAME: LL OR GATE; GENERIC_PART_NUMBER: SN74LVC1G32; INDUSTRY_STD_PKG_TYPE: SOT23; MANUFACTURER: Texas Instruments; MANUFACTURER_PART_NUMBER: sn74lvc1g32_dbv_5; PACKAGE_DESIGNATOR: DBV; PIN_COUNT: 5; VENDOR: Texas Instruments
U32 = Module_ICs:SN74CB3Q3257PWR; APPLICATION_BUILDNUMBER: *; COMPTYPE: IC; MANUFACTURER: Texas Instruments; MOUNTTYPE: SMT; PACKAGEREFERENCE: PW0016A; PARTNUMBER: SN74CB3Q3257PWR; PIN_COUNT: 16; REFDES: RefDes; ROHS: Y; TYPE: TYPE
U34 = Module_Regulators:LM5140QRWGRQ1; MANUFACTURER: Texas Instruments; PARTNUMBER: LM5140QRWGRQ1; REFDES: RefDes; TYPE: TYPE
U35 = Module_Regulators:TPS62087RLTR; COMPTYPE: IC; MANUFACTURER: Texas Instruments; MOUNTTYPE: SMT; PACKAGEREFERENCE: RLT0007A; PARTNUMBER: TPS62087RLTR; PIN_COUNT: 7; REFDES: RefDes; ROHS: Y; TYPE: TYPE
U36 U42 = Module_Regulators:TPS62097RWKR; ALTERNATEPARTNUMBER: TPS62097RWKT; APPLICATION_BUILDNUMBER: *; COMPTYPE: IC; MANUFACTURER: Texas Instruments; MOUNTTYPE: SMT; PACKAGEREFERENCE: RWK0011B; PARTNUMBER: TPS62097RWKR; PIN_COUNT: 11; REFDES: RefDes; ROHS: Y; TYPE: TYPE
U37 = Module_Regulators:TLV70718DQNR; MANUFACTURER: Texas Instruments; PARTNUMBER: TLV70718DQNR; REFDES: RefDes; TYPE: TYPE
U38 = Module_Regulators:TPS62363YZHR; ALTERNATEPARTNUMBER: TPS62363YZHT; APPLICATION_BUILDNUMBER: *; COMPTYPE: IC; MANUFACTURER: Texas Instruments; MOUNTTYPE: SMT; PACKAGEREFERENCE: YZH0016AFAF; PARTNUMBER: TPS62363YZHR; PIN_COUNT: 16; REFDES: RefDes; ROHS: Y; TYPE: TYPE
U39 = Module_Regulators:TPS62480RNCR; MANUFACTURER: Texas Instruments; PARTNUMBER: TPS62480RNCR; REFDES: RefDes; TYPE: TYPE
U40 = Module_Regulators:LP5912-1.1DRVR; MANUFACTURER: Texas Instruments; PARTNUMBER: LP59121.1DRVR; REFDES: RefDes; TYPE: TYPE
U41 = Module_Regulators:TPS54334DRCR; ALTERNATEPARTNUMBER: TPS54334DRCT; APPLICATION_BUILDNUMBER: *; COMPTYPE: IC; MANUFACTURER: Texas Instruments; MOUNTTYPE: SMT; PACKAGEREFERENCE: DRC0010J; PARTNUMBER: TPS54334DRCR; PIN_COUNT: 11; REFDES: RefDes; ROHS: Y; TYPE: TYPE
U43 = Module_Regulators:TPS73512DRBR; ALTERNATEPARTNUMBER: TPS73512DRBT; APPLICATION_BUILDNUMBER: *; COMPTYPE: IC; MANUFACTURER: Texas Instruments; MOUNTTYPE: SMT; PACKAGEREFERENCE: DRB0008A; PARTNUMBER: TPS73512DRBR; PIN_COUNT: 9; REFDES: RefDes; ROHS: Y; TYPE: TYPE
U44 = Module_Regulators:TPS51206DSQR; MANUFACTURER: Texas Instruments; PARTNUMBER: TPS51206DSQR; REFDES: RefDes; TYPE: TYPE
U45 = Module_Regulators:TPS62095RGTR; MANUFACTURER: Texas Instruments; PARTNUMBER: TPS62095RGTR; REFDES: RefDes; TYPE: TYPE
U47 U48 = Module_ICs:SN74LVC3G17_DCU_8; DATASHEETURL: httpwww.ti.comlitgpnSN74LVC3G17; FAMILY_NAME: LL SCHMITT TRIGGER BUFFER; GENERIC_PART_NUMBER: SN74LVC3G17; INDUSTRY_STD_PKG_TYPE: US8; MANUFACTURER: Texas Instruments; MANUFACTURER_PART_NUMBER: sn74lvc3g17_dcu_8; PACKAGE_DESIGNATOR: DCU; PIN_COUNT: 8; VENDOR: Texas Instruments
U53 U59 = Module_Regulators:TPS2051B_D_8; DATASHEETURL: httpwww.ti.comlitgpnTPS2051B; FAMILY_NAME: USB POWER SWITCH; GENERIC_PART_NUMBER: TPS2051B; INDUSTRY_STD_PKG_TYPE: SOIC; MANUFACTURER: Texas Instruments; MANUFACTURER_PART_NUMBER: tps2051b_d_8; PACKAGE_DESIGNATOR: D; PIN_COUNT: 8; VENDOR: Texas Instruments
U56 = INTERFACE-MCP23017-E_SOIC28_:INTERFACE-MCP23017-E(SOIC28): 310070050; AVAILABILITY: Unavailable; DESCRIPTION: MCP23017 Series 5.5 V 1.7 MHz SMT 16-Bit I2C I/O Expander - SOIC-28; MF: Microchip; MP: MCP23017-E/SO; PACKAGE: SOIC-28 Microchip; PRICE: None
U60 = Module_ICs:TPD4S012_DRY_6; DATASHEETURL: httpwww.ti.comlitgpnTPD4S012; FAMILY_NAME: ESD Solution; GENERIC_PART_NUMBER: TPD4S012; INDUSTRY_STD_PKG_TYPE: SON; MANUFACTURER: Texas Instruments; MANUFACTURER_PART_NUMBER: tpd4s012_dry_6; PACKAGE_DESIGNATOR: DRY; PIN_COUNT: 6; VENDOR: Texas Instruments
U73 = Module_ICs:CDCLVC1310RHBR; MANUFACTURER: Texas Instruments; PARTNUMBER: CDCLVC1310RHBR; REFDES: RefDes; TYPE: TYPE
U76 = Module_Regulators:TPS3711DDCR; MANUFACTURER: Texas Instruments; PARTNUMBER: TPS3711DDCR; REFDES: RefDes; TYPE: TYPE
U77 = Module_Regulators:TPS3897_DRY_6; DATASHEETURL: httpwww.ti.comlitgpnTPS3897; FAMILY_NAME: SUPERVISOR AND RESET IC; GENERIC_PART_NUMBER: TPS3897; INDUSTRY_STD_PKG_TYPE: SON; MANUFACTURER: Texas Instruments; MANUFACTURER_PART_NUMBER: tps3897_dry_6; PACKAGE_DESIGNATOR: DRY; PIN_COUNT: 6; VENDOR: Texas Instruments
U78 = Module_Gates:SN74LVC1G11_DCK_6; DATASHEETURL: httpwww.ti.comlitgpnSN74LVC1G11; FAMILY_NAME: LL AND GATE; GENERIC_PART_NUMBER: SN74LVC1G11; INDUSTRY_STD_PKG_TYPE: SC70; MANUFACTURER: Texas Instruments; MANUFACTURER_PART_NUMBER: sn74lvc1g11_dck_6; PACKAGE_DESIGNATOR: DCK; PIN_COUNT: 6; VENDOR: Texas Instruments
U79 = Module_Regulators:LM5060Q1MMX/NOPB; ALTERNATEPARTNUMBER: LM5060Q1MMNOPB; APPLICATION_BUILDNUMBER: *; COMPTYPE: IC; MANUFACTURER: Texas Instruments; MOUNTTYPE: SMT; PACKAGEREFERENCE: DGS0010A; PARTNUMBER: LM5060Q1MMXNOPB; PIN_COUNT: 10; REFDES: RefDes; ROHS: Y; TYPE: TYPE
U80 = MIC5060YML-TR:MIC5060YML-TR: MIC5060 Series 30 V Ultra Small High Side MOSFET Driver - MLF-8; AVAILABILITY: Unavailable; DESCRIPTION: MIC5060 Series 30 V Ultra Small High Side MOSFET Driver - MLF-8; MF: Microchip; MP: MIC5060YML-TR; PACKAGE: SO-8 Microchip; PRICE: None
U83 = Module_Regulators:LM25118Q1MHX/NOPB; ALTERNATEPARTNUMBER: LM25118Q1MHNOPB; APPLICATION_BUILDNUMBER: *; COMPTYPE: IC; MANUFACTURER: Texas Instruments; MOUNTTYPE: SMT; PACKAGEREFERENCE: PWP0020A; PARTNUMBER: LM25118Q1MHXNOPB; PIN_COUNT: 21; REFDES: RefDes; ROHS: Y; TYPE: TYPE
U$1 = TPS79601:VSON8
U$2 = SOT65P210X110-5N:LM4040B25IDCKR13
U$3-U$7 = Module_ICs:MT40A1G8WE-083E:B
U$9 = adafruit:CR1220: CR1216/CR1220/CR1225 12mm 3V lithium coin cell Great for battery packup. Both SMT and THM holders. Note the THM package has the ground pads on both sides of the PCB so that the masks are the same - this reduces the cost
U$10 = IS21ES16G:IS21ES16G
U$11 U$12 U$17 = Module_Connectors:JK0-2500NL
U$13 U$14 = 24LC512-E_P:24LC512-E/P: 512K I2C CMOS Serial EEPROM; AVAILABILITY: Unavailable; DESCRIPTION: EEPROM Serial-I2C 512K-bit 64K x 8 3.3V/5V Automotive 8-Pin PDIP Tube; MF: Microchip; MP: 24LC512-E/P; PACKAGE: DIP-8 Microchip; PRICE: None
U$15 U$16 = tmp10x:TMP100: Digital Temperature sensor from Texas Instruments Digital output : I2C Resolution : 9 to 12bit Accuracy : 2'C from -25'C to 85'C ; 3'C from -55'C to 125'C Supply : 2,7 to 5,5V / 45uA (standby 0,1uA)
U$18 = FIL_NFM21PC105B1C3D:NFM21PC
U$19 U$36 = Module_Diodes:BZX84C2V4LT1-D
U$20 U$21 = DB2441700L:DB2441700L
U$22 U$25 = Module_Inductors:XEL6030-152MEB
U$28 U$30-U$32 = Module_Inductors:XFL4015-471MEB
U$29 U$34 U$35 = Module_Inductors:XFL4020-102MEB
U$33 = Module_Inductors:XEL4030-682ME_
U$38 = Module_ICs:MT35XU512ABA1G12-0SIT
U$39 = Module_Inductors:XAL40XX
U$40 U$41 U$44 U$45 = Module_Diodes:SSB44-E3/52T
U$42 U$43 = Module_ICs:SI4442DY
X1 = con-molex:5566-6: Mini FIT connector 6 pol Source: http://www.molex.com; MF: MOLEX; MPN: 95566-61002; OC_FARNELL: unknown; OC_NEWARK: 22K8620
X2 = con-cypressindustries:MINI-USB_SHIELD5P2-: MINI USB-B R/A DIP 5pol. Source: www.cypressindustries.com
X4 = con-usb:USB: USB Connectors
Y1 = SparkFun-Clocks:CRYSTAL-32.768KHZ: 32.768kHz Crystal Frequency: 32.768kHz Frequency Stability: ±20ppm Load Capacitance: 12.5pF (PTH-2X6 & SMD-3.2X1.5), 6pF (SMD-2X6) SparkFun Products: SparkFun BigTime Watch Kit <https://www.sparkfun.com/products/11734> SparkFun nRF52832 Breakout <https://www.sparkfun.com/products/13990> SparkFun Real Time Clock Module <https://www.sparkfun.com/products/12708>; PROD_ID: XTAL-10112
Y2 = SparkFun-Clocks:CRYSTAL-16MHZ: 16MHz Crystal Digikey Example <http://www.digikey.com/product-search/en?keywords=535-9122-1-ND> Frequency: 16MHz Frequency Stability: ±50ppm Frequency Tolerance: ±20ppm Load Capacitance: 18pF SparkFun Products: Pro Micro -5V/16MHz <https://www.sparkfun.com/products/12640> SparkFun Serial Enabled LCD Kit <https://www.sparkfun.com/products/10097>; PROD_ID: XTAL-08218; SF_ID: COM-00094
Y3 Y4 Y6 = SparkFun-Clocks:CRYSTAL: Crystals (Generic) These are passive quartz crystals, which can be used as a clock source for a microcontroller. Crystal's are two-terminal devices. They require external "load" capacitors to generate an oscillating signal.

## Net classes
0 default: width 0.102 mm, clearance 0.102 mm
1 addr: width 0.102 mm, clearance 0.102 mm
2 data: width 0.102 mm, clearance 0.102 mm
3 clk: width 0.102 mm, clearance 0.102 mm
4 ctrl: width 0.102 mm, clearance 0.102 mm
5 dqs: width 0.102 mm, clearance 0.102 mm
6 dm: width 0.102 mm, clearance 0.102 mm
7 6mil: width 0.152 mm, clearance 0.152 mm
8 5mil: width 0.127 mm, clearance 0.127 mm